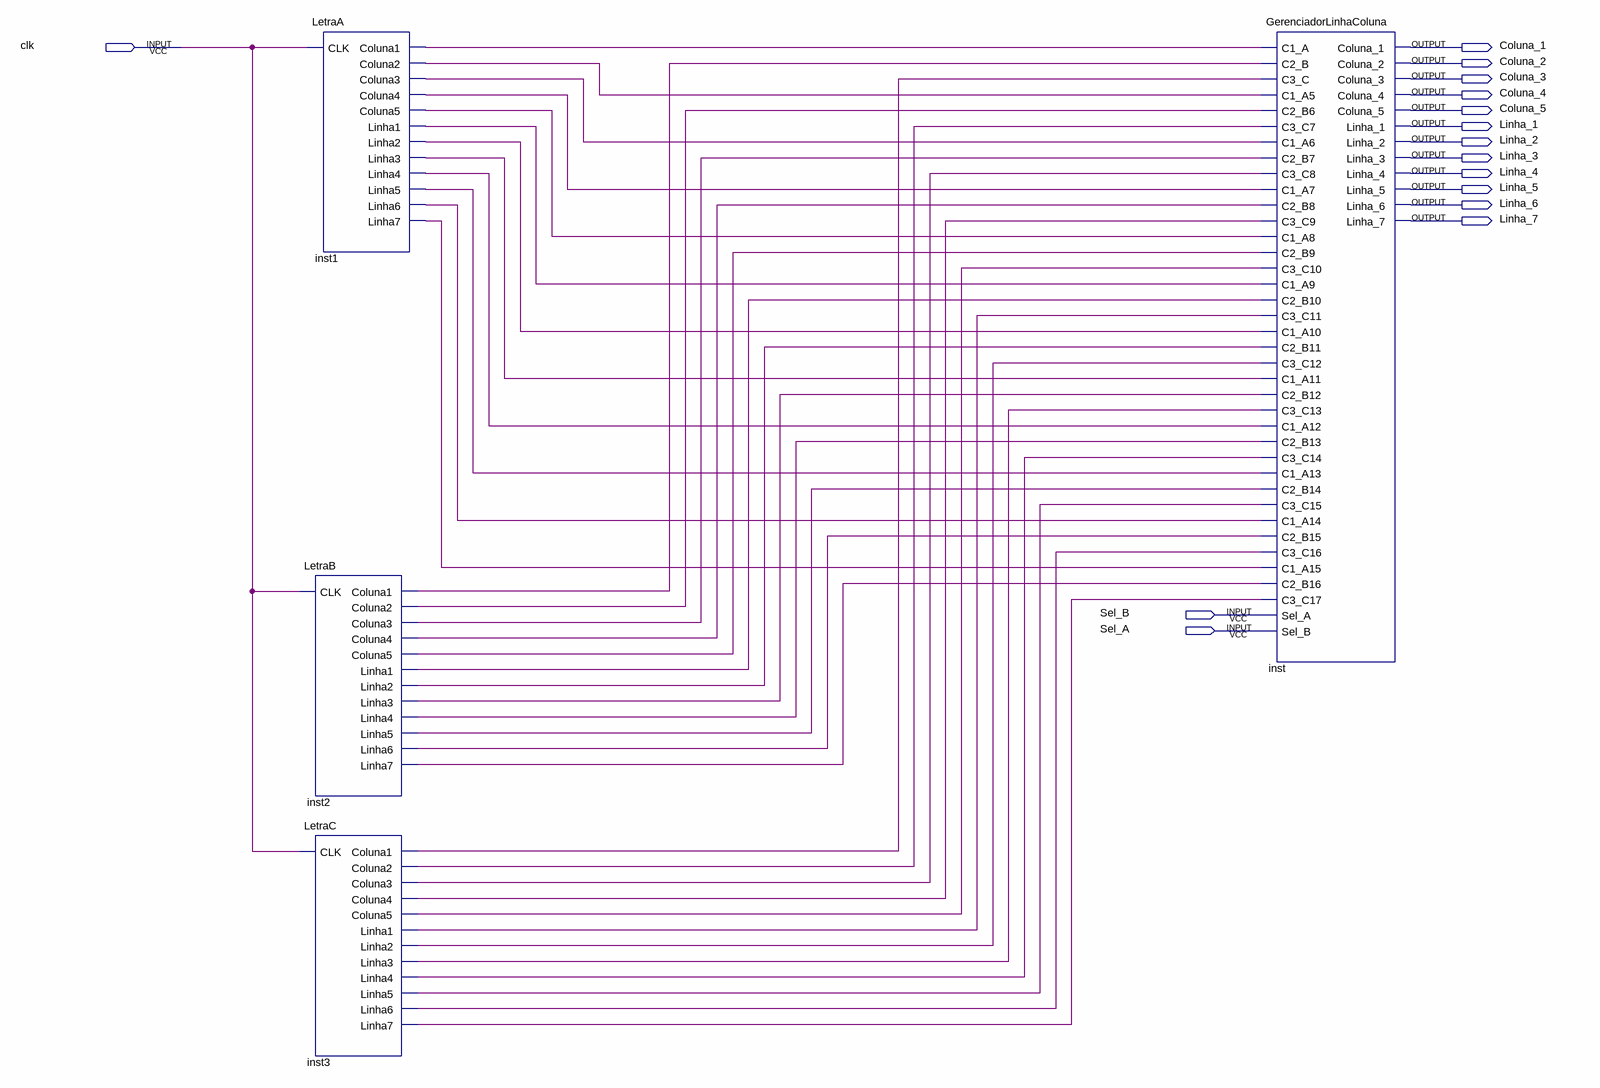
[diagram p0: schematic sheet]
// Quartus schematic LetrasMatriz.bdf as structural Verilog: 4 symbols, 15 pins
module LetrasMatriz (
  input  clk,
  input  Sel_B,
  input  Sel_A,
  output Coluna_1,
  output Coluna_2,
  output Coluna_3,
  output Coluna_4,
  output Coluna_5,
  output Linha_1,
  output Linha_2,
  output Linha_3,
  output Linha_4,
  output Linha_5,
  output Linha_6,
  output Linha_7
);

  wire inst1_coluna1, inst1_coluna2, inst1_coluna3, inst1_coluna4, inst1_coluna5, inst1_linha1, inst1_linha2,
       inst1_linha3, inst1_linha4, inst1_linha5, inst1_linha6, inst1_linha7, inst2_coluna1, inst2_coluna2,
       inst2_coluna3, inst2_coluna4, inst2_coluna5, inst2_linha1, inst2_linha2, inst2_linha3, inst2_linha4,
       inst2_linha5, inst2_linha6, inst2_linha7, inst3_coluna1, inst3_coluna2, inst3_coluna3, inst3_coluna4,
       inst3_coluna5, inst3_linha1, inst3_linha2, inst3_linha3, inst3_linha4, inst3_linha5, inst3_linha6,
       inst3_linha7;

  LetraA inst1 (
    .CLK(clk), .Coluna1(inst1_coluna1), .Coluna2(inst1_coluna2), .Coluna3(inst1_coluna3),
    .Coluna4(inst1_coluna4), .Coluna5(inst1_coluna5), .Linha1(inst1_linha1), .Linha2(inst1_linha2),
    .Linha3(inst1_linha3), .Linha4(inst1_linha4), .Linha5(inst1_linha5), .Linha6(inst1_linha6),
    .Linha7(inst1_linha7));
  LetraB inst2 (
    .CLK(clk), .Coluna1(inst2_coluna1), .Coluna2(inst2_coluna2), .Coluna3(inst2_coluna3),
    .Coluna4(inst2_coluna4), .Coluna5(inst2_coluna5), .Linha1(inst2_linha1), .Linha2(inst2_linha2),
    .Linha3(inst2_linha3), .Linha4(inst2_linha4), .Linha5(inst2_linha5), .Linha6(inst2_linha6),
    .Linha7(inst2_linha7));
  LetraC inst3 (
    .CLK(clk), .Coluna1(inst3_coluna1), .Coluna2(inst3_coluna2), .Coluna3(inst3_coluna3),
    .Coluna4(inst3_coluna4), .Coluna5(inst3_coluna5), .Linha1(inst3_linha1), .Linha2(inst3_linha2),
    .Linha3(inst3_linha3), .Linha4(inst3_linha4), .Linha5(inst3_linha5), .Linha6(inst3_linha6),
    .Linha7(inst3_linha7));
  GerenciadorLinhaColuna inst (
    .C1_A(inst1_coluna1), .C2_B(inst2_coluna1), .C3_C(inst3_coluna1), .C1_A5(inst1_coluna2),
    .C2_B6(inst2_coluna2), .C3_C7(inst3_coluna2), .C1_A6(inst1_coluna3), .C2_B7(inst2_coluna3),
    .C3_C8(inst3_coluna3), .C1_A7(inst1_coluna4), .C2_B8(inst2_coluna4), .C3_C9(inst3_coluna4),
    .C1_A8(inst1_coluna5), .C2_B9(inst2_coluna5), .C3_C10(inst3_coluna5), .C1_A9(inst1_linha1),
    .C2_B10(inst2_linha1), .C3_C11(inst3_linha1), .C1_A10(inst1_linha2), .C2_B11(inst2_linha2),
    .C3_C12(inst3_linha2), .C1_A11(inst1_linha3), .C2_B12(inst2_linha3), .C3_C13(inst3_linha3),
    .C1_A12(inst1_linha4), .C2_B13(inst2_linha4), .C3_C14(inst3_linha4), .C1_A13(inst1_linha5),
    .C2_B14(inst2_linha5), .C3_C15(inst3_linha5), .C1_A14(inst1_linha6), .C2_B15(inst2_linha6),
    .C3_C16(inst3_linha6), .C1_A15(inst1_linha7), .C2_B16(inst2_linha7), .C3_C17(inst3_linha7),
    .Sel_A(Sel_B), .Sel_B(Sel_A), .Coluna_1(Coluna_1), .Coluna_2(Coluna_2), .Coluna_3(Coluna_3),
    .Coluna_4(Coluna_4), .Coluna_5(Coluna_5), .Linha_1(Linha_1), .Linha_2(Linha_2), .Linha_3(Linha_3),
    .Linha_4(Linha_4), .Linha_5(Linha_5), .Linha_6(Linha_6), .Linha_7(Linha_7));
endmodule
